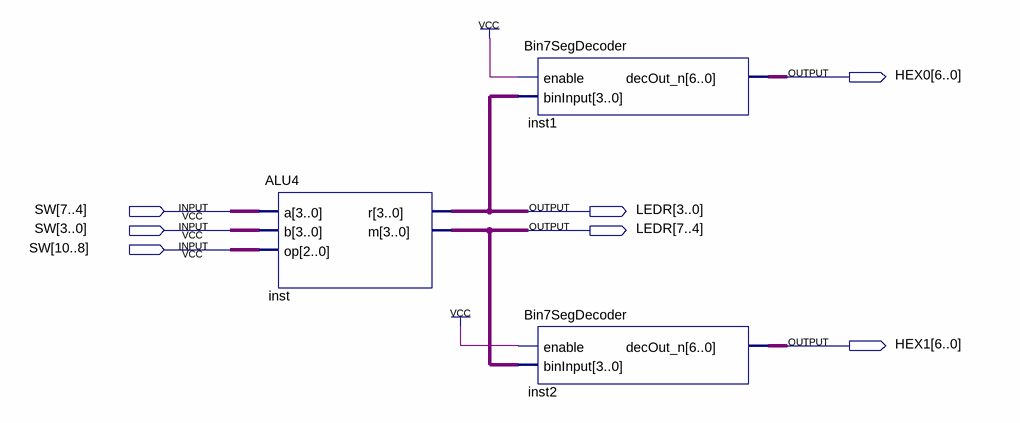
[diagram p0: schematic sheet]
// Quartus schematic ALUDemo.bdf as structural Verilog: 3 symbols, 7 pins
module ALUDemo (
  input  [10:0] SW,
  output [6:0] HEX0,
  output [7:0] LEDR,
  output [6:0] HEX1
);

  ALU4 inst (.a(SW[7:4]), .b(SW[3:0]), .op(SW[10:8]), .r(LEDR[3:0]), .m(LEDR[7:4]));
  Bin7SegDecoder inst1 (.enable(1'b1), .binInput(LEDR[3:0]), .decOut_n(HEX0));
  Bin7SegDecoder inst2 (.enable(1'b1), .binInput(LEDR[7:4]), .decOut_n(HEX1));
endmodule
